# EAGLE design ir (EAGLE 8.6.0)
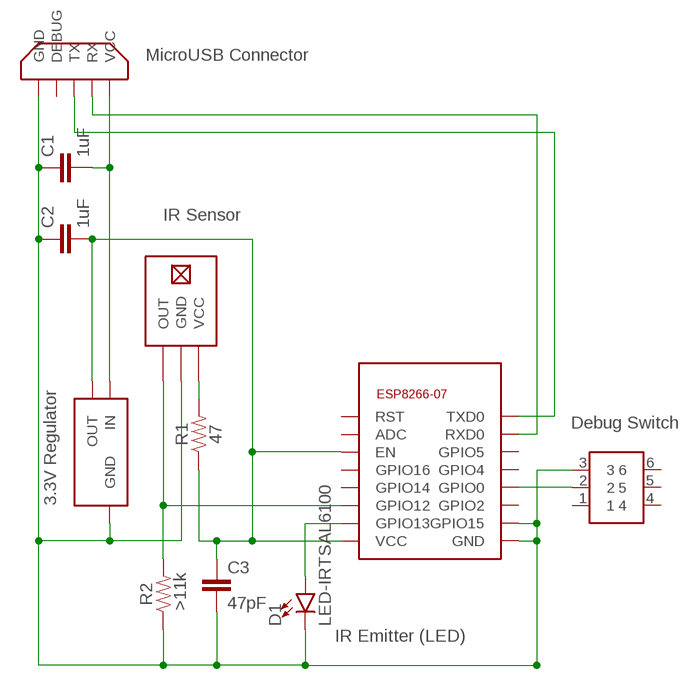
[diagram p0: schematic, sheet 1]

## Parts
C1  1uF  0.33UF/330NF-0805-50V-10%  [0805]
C2  1uF  0.33UF/330NF-0805-50V-10%  [0805]
C3  47pF  0.33UF/330NF-0805-50V-10%  [0805]
D1  LED-IRTSAL6100  [LED_5MM]
R1  47  RESISTOR0805  [0805]
R2  >11k  RESISTOR0805  [0805]
U$1  AX-1838HSHORIZ  [AX-1838HS-HORIZ]
U$2  ESP8266-07SMD  [ESP8266-07]
U$3  AYZ0202AGRL  [AYZ0202AGRL]
U$4  MICROUSB609-4613-1-ND  [MICROUSB]
U$5  AZ1117E  [SOT-223]

## Nets
N$1: C1.2 U$4.VCC U$5.P$4(IN)
N$2: C1.1 C2.1 C3.2 D1.K(C) R2.1 U$1.GND U$2.GND U$2.GPIO15 U$3.3 U$4.GND U$5.P$3(GND)
N$3: R2.2 U$1.OUT U$2.GPIO12
N$4: U$2.GPIO0 U$3.2
N$5: C2.2 C3.1 R1.1 U$2.EN U$2.VCC U$5.P$1(OUT) U$5.P$2(OUT)
N$6: U$2.RXD0 U$4.RX
N$7: U$2.TXD0 U$4.TX
N$8: D1.A U$2.GPIO13
N$10: R1.2 U$1.VCC
Unconnected: U$2.ADC U$2.GPIO2 U$2.GPIO4 U$2.GPIO5 U$2.GPIO14 U$2.GPIO16 U$2.RST U$3.1 U$3.4 U$3.5 U$3.6 U$4.DEBUG

## Notes on the sheet
- MicroUSB Connector
- IR Sensor
- Debug Switch
- 3.3V Regulator
- IR Emitter (LED)

## Library data of the parts
C1-C3 = SparkFun-Capacitors:0.33UF/330NF: 0.33µF/330nF ceramic capacitors A capacitor is a passive two-terminal electrical component used to store electrical energy temporarily in an electric field.; PROD_ID: CAP-08469; VALUE: 0.33µF
D1 = SparkFun-LED:LED-IR: Infrared LED (IR) Wavelength: 940nm Packages: TSAL6100 LTE302 - Side firing. Check SparkFun-Sensors.lbr for the receiver SparkFun Products: ZX Distance and Gesture Sensor <[https://www.sparkfun.com/products/12780]> Infrared Emitters and Detectors <https://www.sparkfun.com/products/241>; PROD_ID: DIO-12058
R1 R2 = SparkFun-Resistors:RESISTOR: Generic Resistor Package
U$1 = IoT:AX-1838HS
U$2 = IoT:ESP8266-07
U$3 = IoT:AYZ0202AGRL
U$4 = IoT:MICROUSB
U$5 = IoT:AZ1117E: AZ1117E - 3.3 volt regulator Technical Specifications: Max Current 1.3 A Connect 1.0 uF cap from GND to IN Connect 1.0 uF cap from GND to OUT

## Board
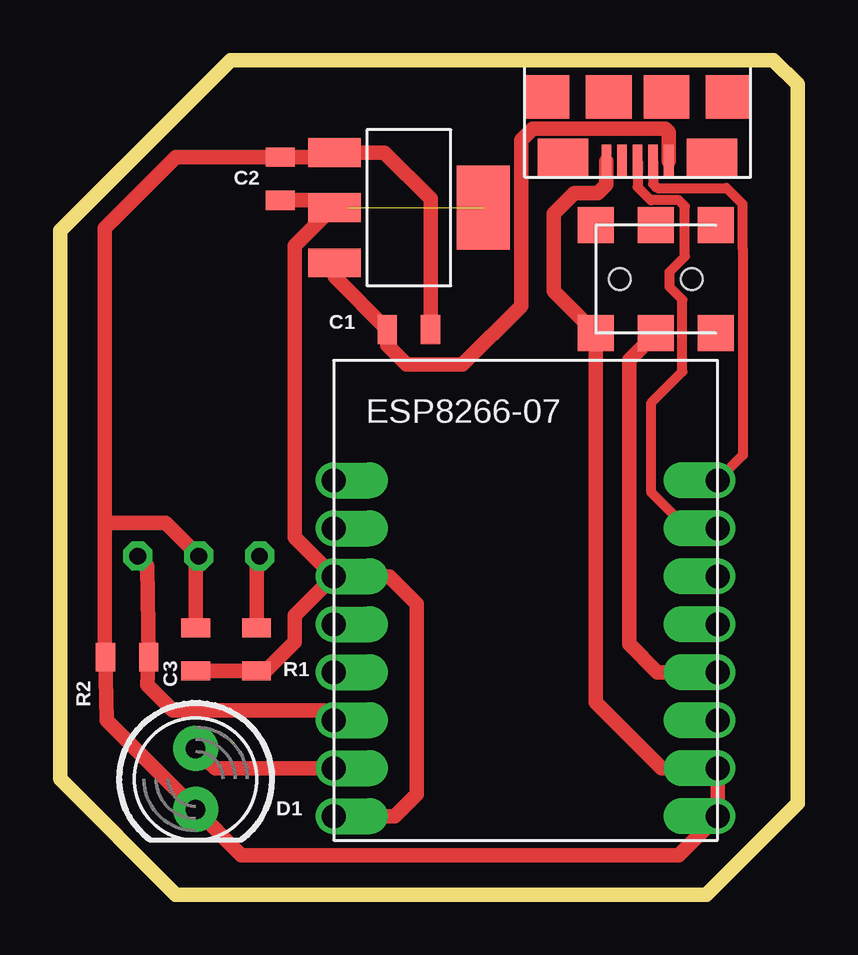
[diagram p1: board, top side]
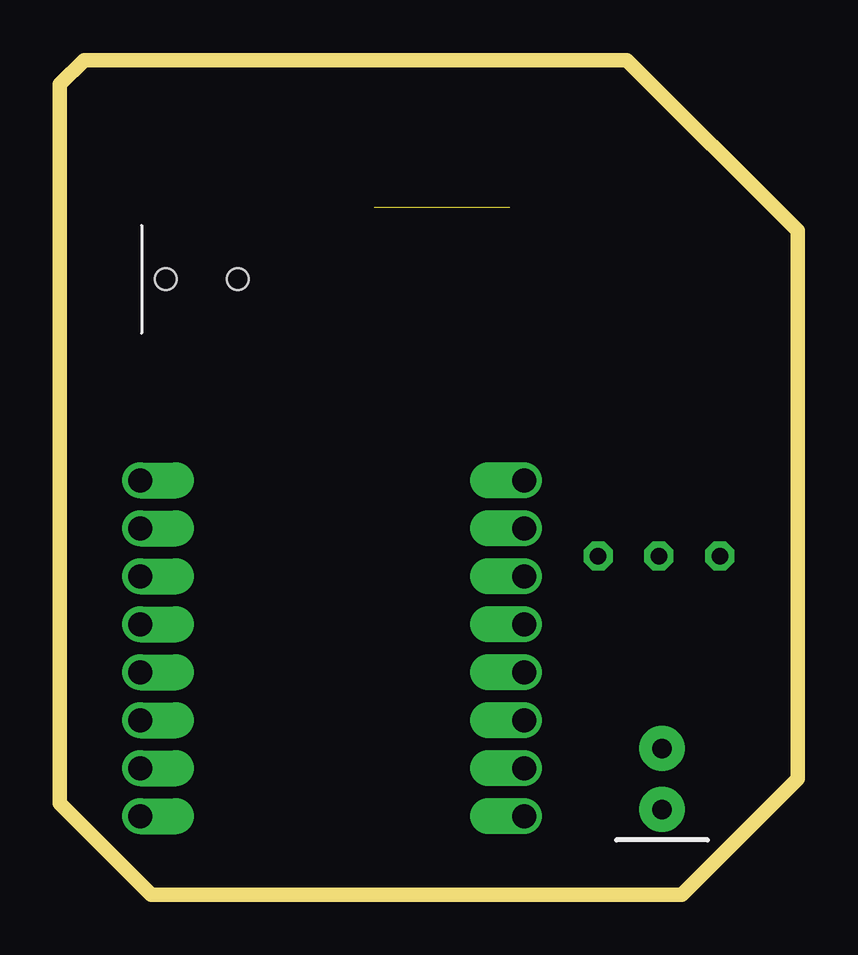
[diagram p2: board, bottom side, seen from below]

Size 30.73 x 34.8 mm. Coordinates in mm from the lower left corner, seen from the top.
Outline: 0,27.69 0,4.83 4.83,0 26.92,0 30.73,3.81 30.73,33.78 29.72,34.8 7.11,34.8 0,27.69
Copper layers (1*16): Top 0.035mm / dielectric 1.5mm / Bottom 0.035mm
Design rules "default": minimum track width 6mil, minimum drill 0.35mm, track to track 6mil, track to pad 6mil, pad to pad 6mil, via to via 6mil, smd to smd 6mil, copper to edge 40mil, drill to drill 6mil, minimum pad ring 10mil, minimum via ring 8mil, stop-mask expansion 4mil, vias tented up to drill 0mil, thermal gap 10mil

### Footprints (pad centres in the part's own frame; a part is rotated, then mirrored left to right if it is on the bottom)
0805 = smd 0.8 x 1.2: 1 -0.9,0; 2 0.9,0
LED_5MM = drill 0.813 pad 1.88: A -1.27,0; K 1.27,0
AX-1838HS-HORIZ = drill 0.7 octagon: GND 3.3,-5; OUT 0.76,-5; VCC 5.84,-5
ESP8266-07 = drill 1 pad 1.2 offset: ADC -6,6; EN -6,4; GND 10,-6; GPIO0 10,0; GPIO2 10,-2; GPIO4 10,2; GPIO5 10,4; GPIO12 -6,-2; GPIO13 -6,-4; GPIO14 -6,0; GPIO15 10,-4; GPIO16 -6,2; RST -6,8; RXD0 10,6; TXD0 10,8; VCC -6,-6
AYZ0202AGRL = smd 1.5 x 1.5: 1 -2.5,2.25; 2 0,2.25; 3 2.5,2.25; 4 -2.5,-2.25; 5 0,-2.25; 6 2.5,-2.25 | hole 0.9: -1.5,0; 1.5,0
MICROUSB = smd 0.4 x 1.35: DEBUG -0.65,0.675; GND -1.3,0.675; RX 0,0.675; TX 0.65,0.675; VCC 1.3,0.675 | smd 2.1 x 1.6: P$1 3.1,0.8; P$6 -3.1,0.8 | smd 1.9 x 1.8: P$2 3.8,3.35; P$3 -3.8,3.35; P$5 -1.2,3.35; P$7 1.2,3.35
SOT-223 = smd 3.5 x 2.2: P$1 0,3.1 | smd 1.2 x 2.2: P$2 0,-3.1; P$3 -2.3,-3.1; P$4 2.3,-3.1

### Placement (x,y rotation side)
C1  14.54,23.56 180 top
C2  9.18,29.84 270 top
C3  5.65,10.22 90 top
D1  5.65,4.83 270 top
R1  8.19,10.22 90 top
R2  2.79,9.91 0 top
U$1  2.48,19.11 0 top
U$2  17.4,9.27 0 top
U$3  24.83,25.65 180 top
U$4  24.07,29.91 0 top
U$5  14.54,28.64 270 top

### Tracks (layer width: path | path; a pad name or v marks a point on that pad's centre or on a via)
N$1
  Top 0.61: 13.63,23.57 C1.2 | U$5.P$4 11.44,25.76 C1.2 | C1.2 13.64,22.9 14.45,22.1 16.76,22.1 19.21,24.54 19.21,31.45 19.7,31.94 25.21,31.94 25.37,31.78 U$4.VCC
N$2
  Top 0.61: U$5.P$3 13.51,30.94 15.44,29.01 C1.1 | 11.36,30.86 U$5.P$3 | C3.2 5.65,13.99 U$1.GND 4.4,15.49 1.86,15.49 | 1.86,15.49 1.86,9.99 R2.1 1.94,7.26 D1.K 7.56,1.65 25.78,1.65 U$2.GND U$2.GPIO15 25.08,5.27 22.33,8.02 U$3.3 20.57,25.16 20.57,28.38 21.43,29.24 22.42,29.24 22.77,29.59 U$4.GND | 1.86,15.49 1.86,27.78 4.83,30.74 C2.1 11.25,30.74 U$5.P$3 | U$5.P$3
N$3
  Top 0.61: U$2.GPIO12 10.99,7.68 4.7,7.68 3.64,8.74 R2.2 3.64,13.71 U$1.OUT
N$4
  Top 0.61: U$3.2 23.72,22.29 23.72,10.45 24.89,9.27 U$2.GPIO0 26.07,9.27
N$5  (1 unrouted)
  Top 0.61: U$5.P$2 12,28.64 | C3.1 R1.1 8.61,9.37 9.78,10.54 9.78,11.65 U$2.EN | U$2.EN 13.72,13.27 14.86,12.13 14.86,4.19 13.94,3.27 U$2.VCC | U$2.EN 9.78,14.89 9.78,27.05 11.37,28.64 U$5.P$2 | C2.2 11.13,28.94 U$5.P$2
N$6
  Top 0.406: U$4.RX 24.07,29.5 24.62,28.95 25.79,28.95 26.04,28.7 26.04,26.61 25.4,25.97 25.4,25.34 25.93,24.8 25.93,21.81 24.64,20.51 24.64,16.76 26.13,15.27 U$2.RXD0
N$7
  Top 0.406: U$4.TX 24.72,29.64 24.89,29.46 27.77,29.46 28.43,28.8 28.43,26.94 28.45,26.92 28.45,18.32 U$2.TXD0
N$8
  Top 0.61: U$2.GPIO13 6.48,5.27 D1.A
N$10
  Top 0.61: U$1.VCC 8.19,13.99 R1.2

### Text on the board
tValues: DBG